# Altium schematic sheet tester.SchDoc
size A0
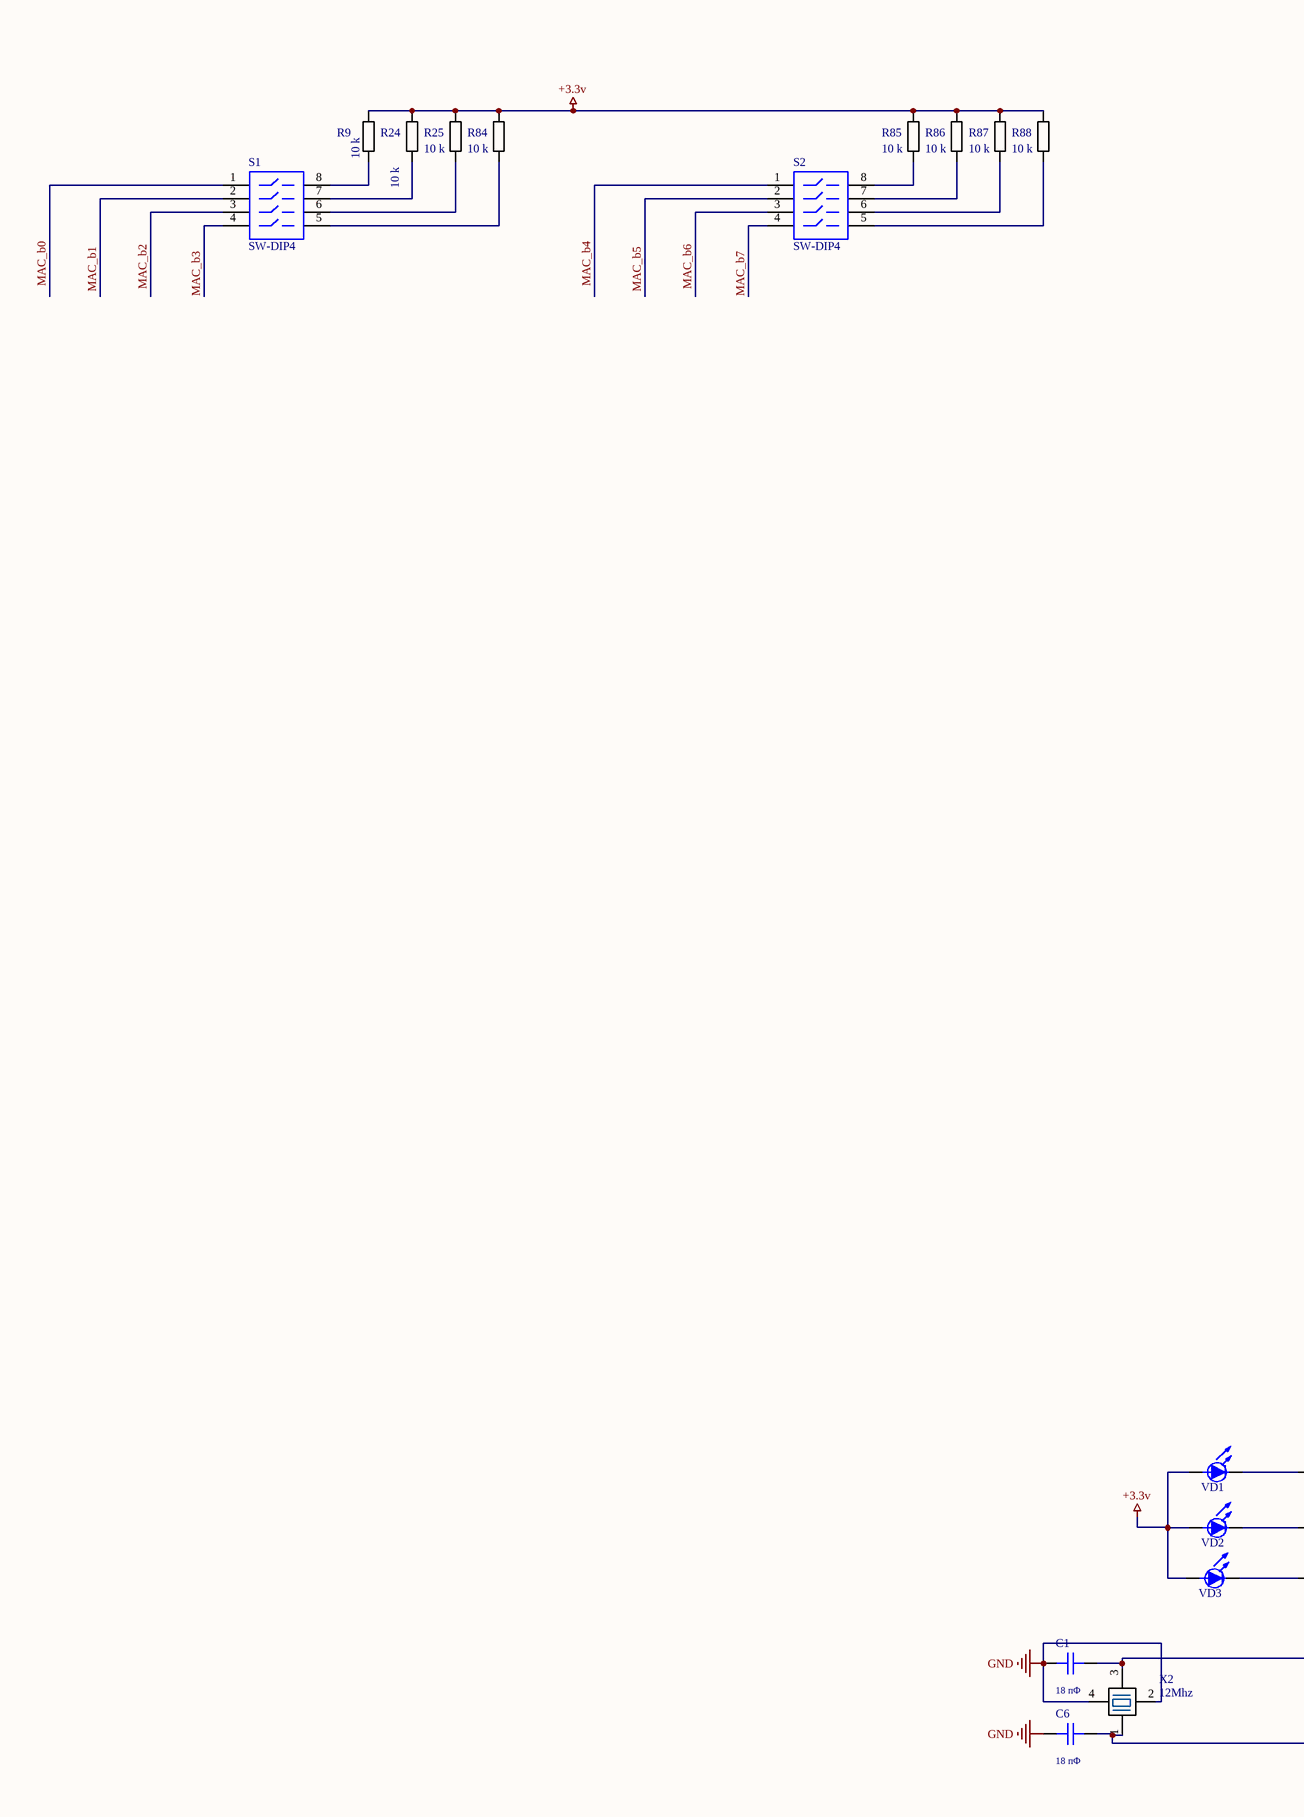
[diagram p0: tester.SchDoc, top left]
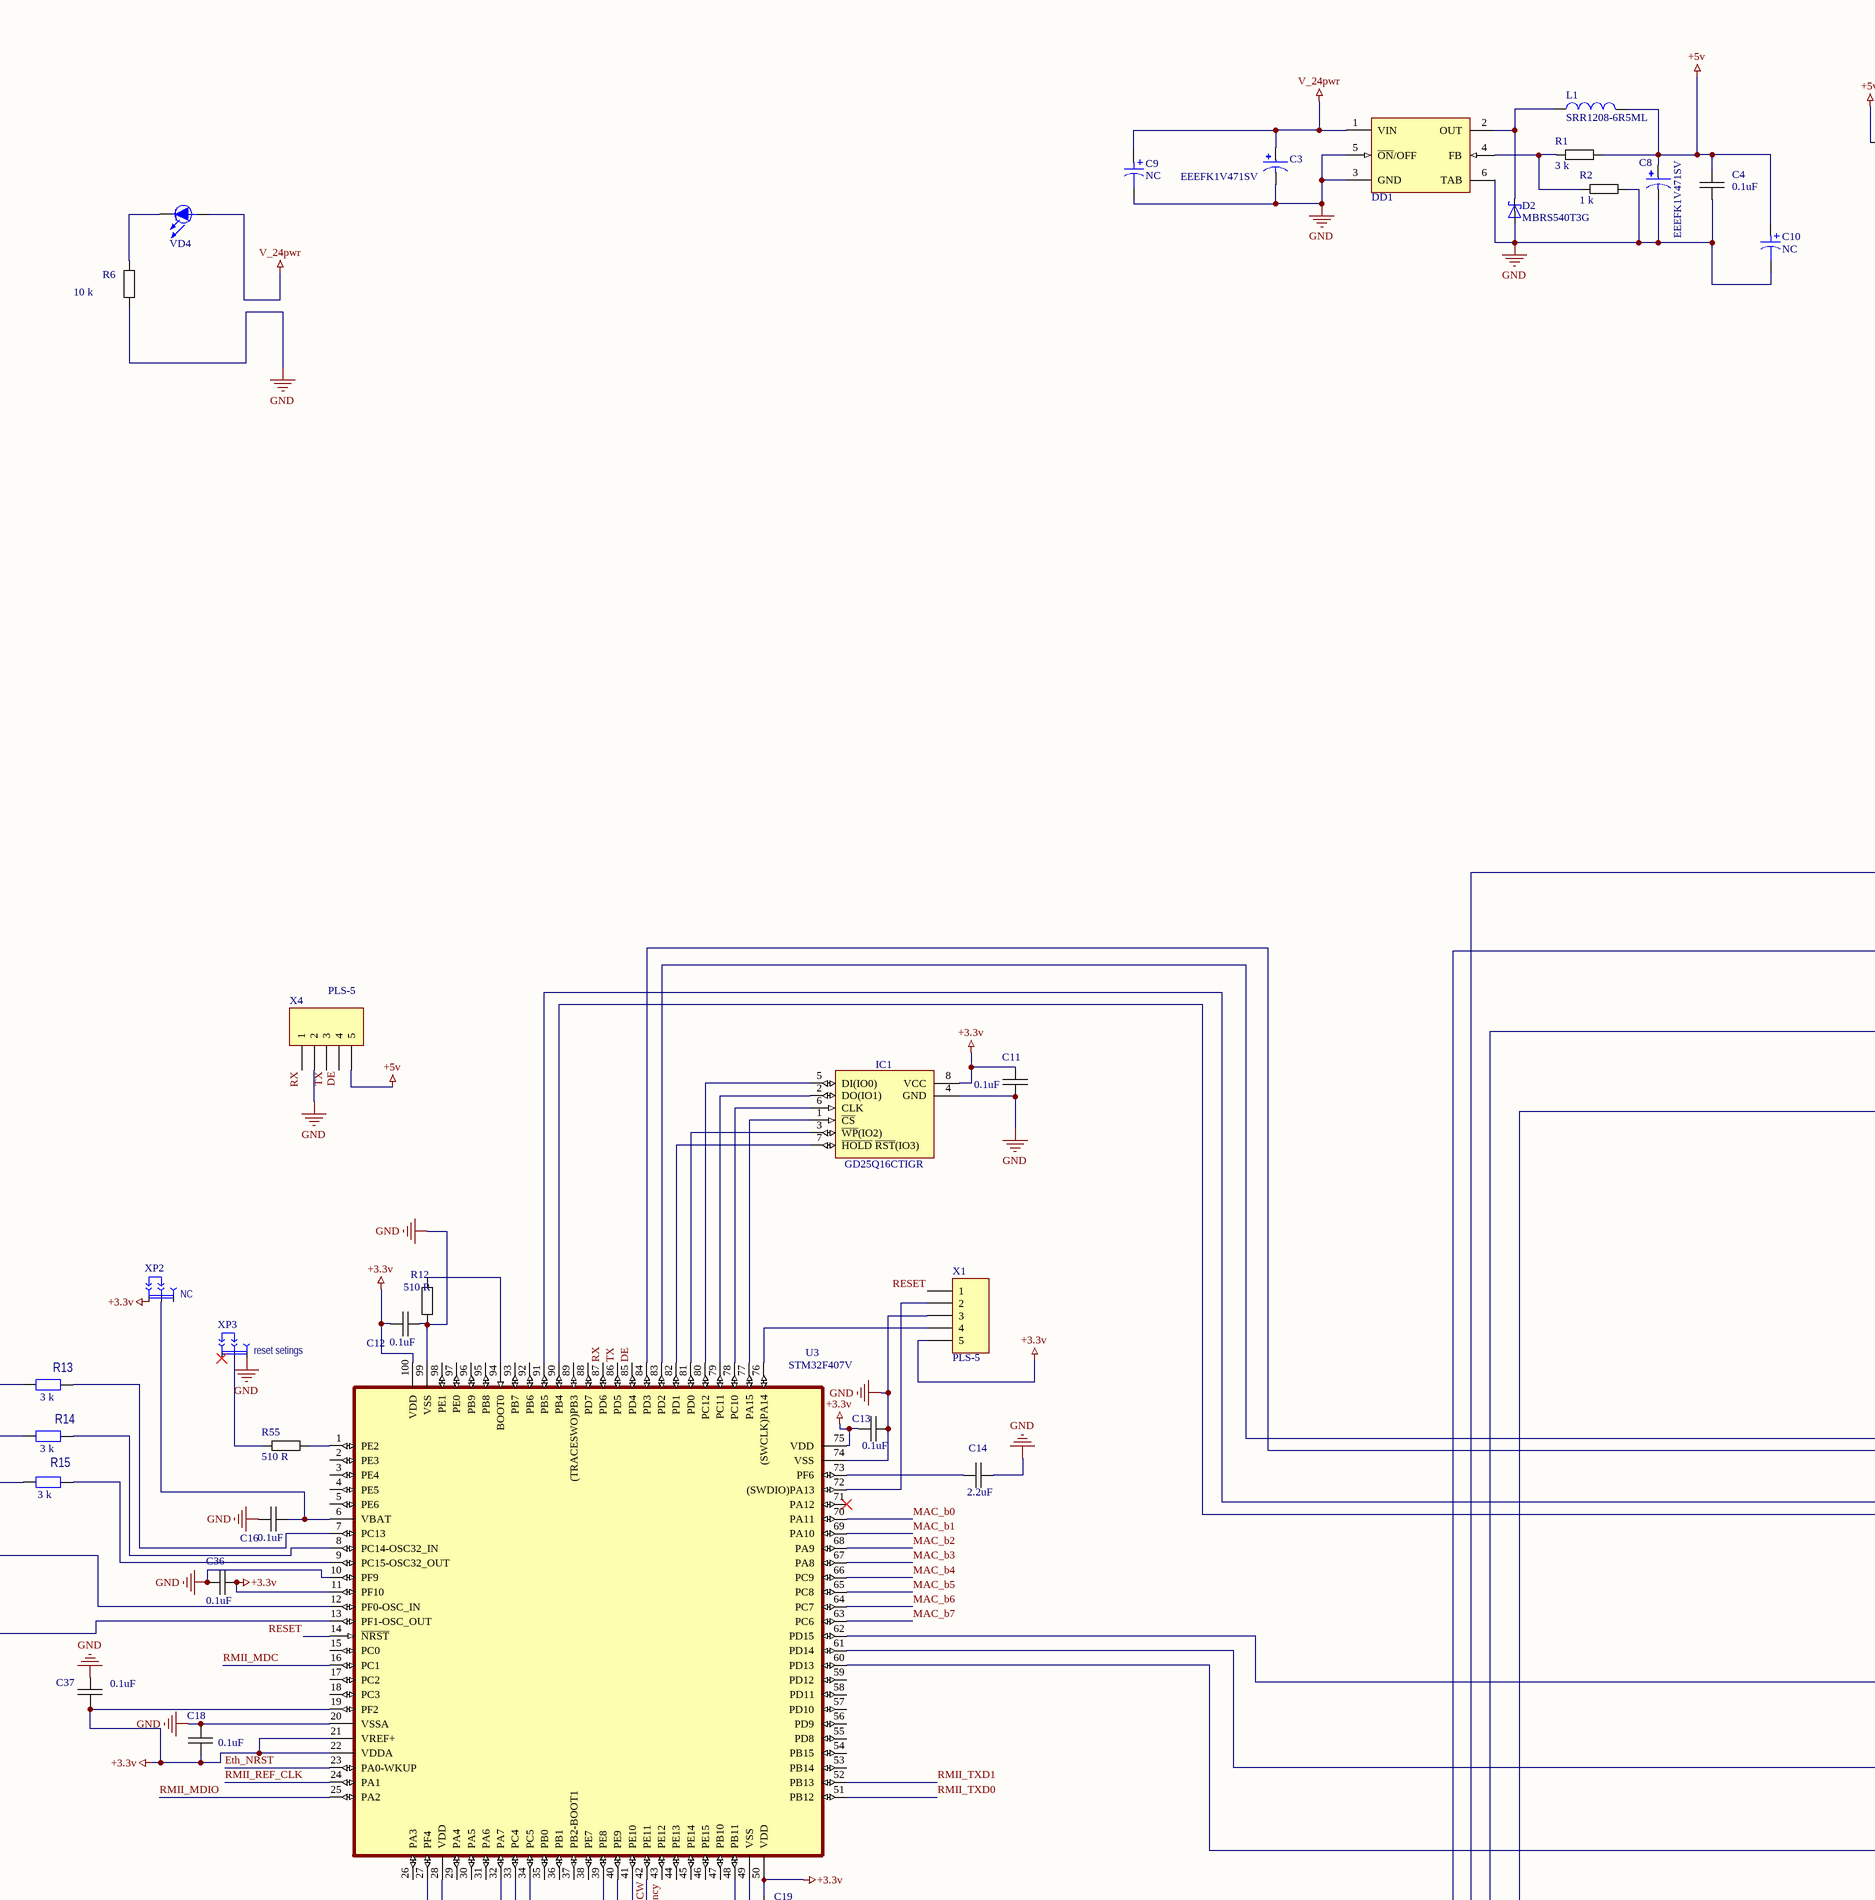
[diagram p1: tester.SchDoc, top middle]
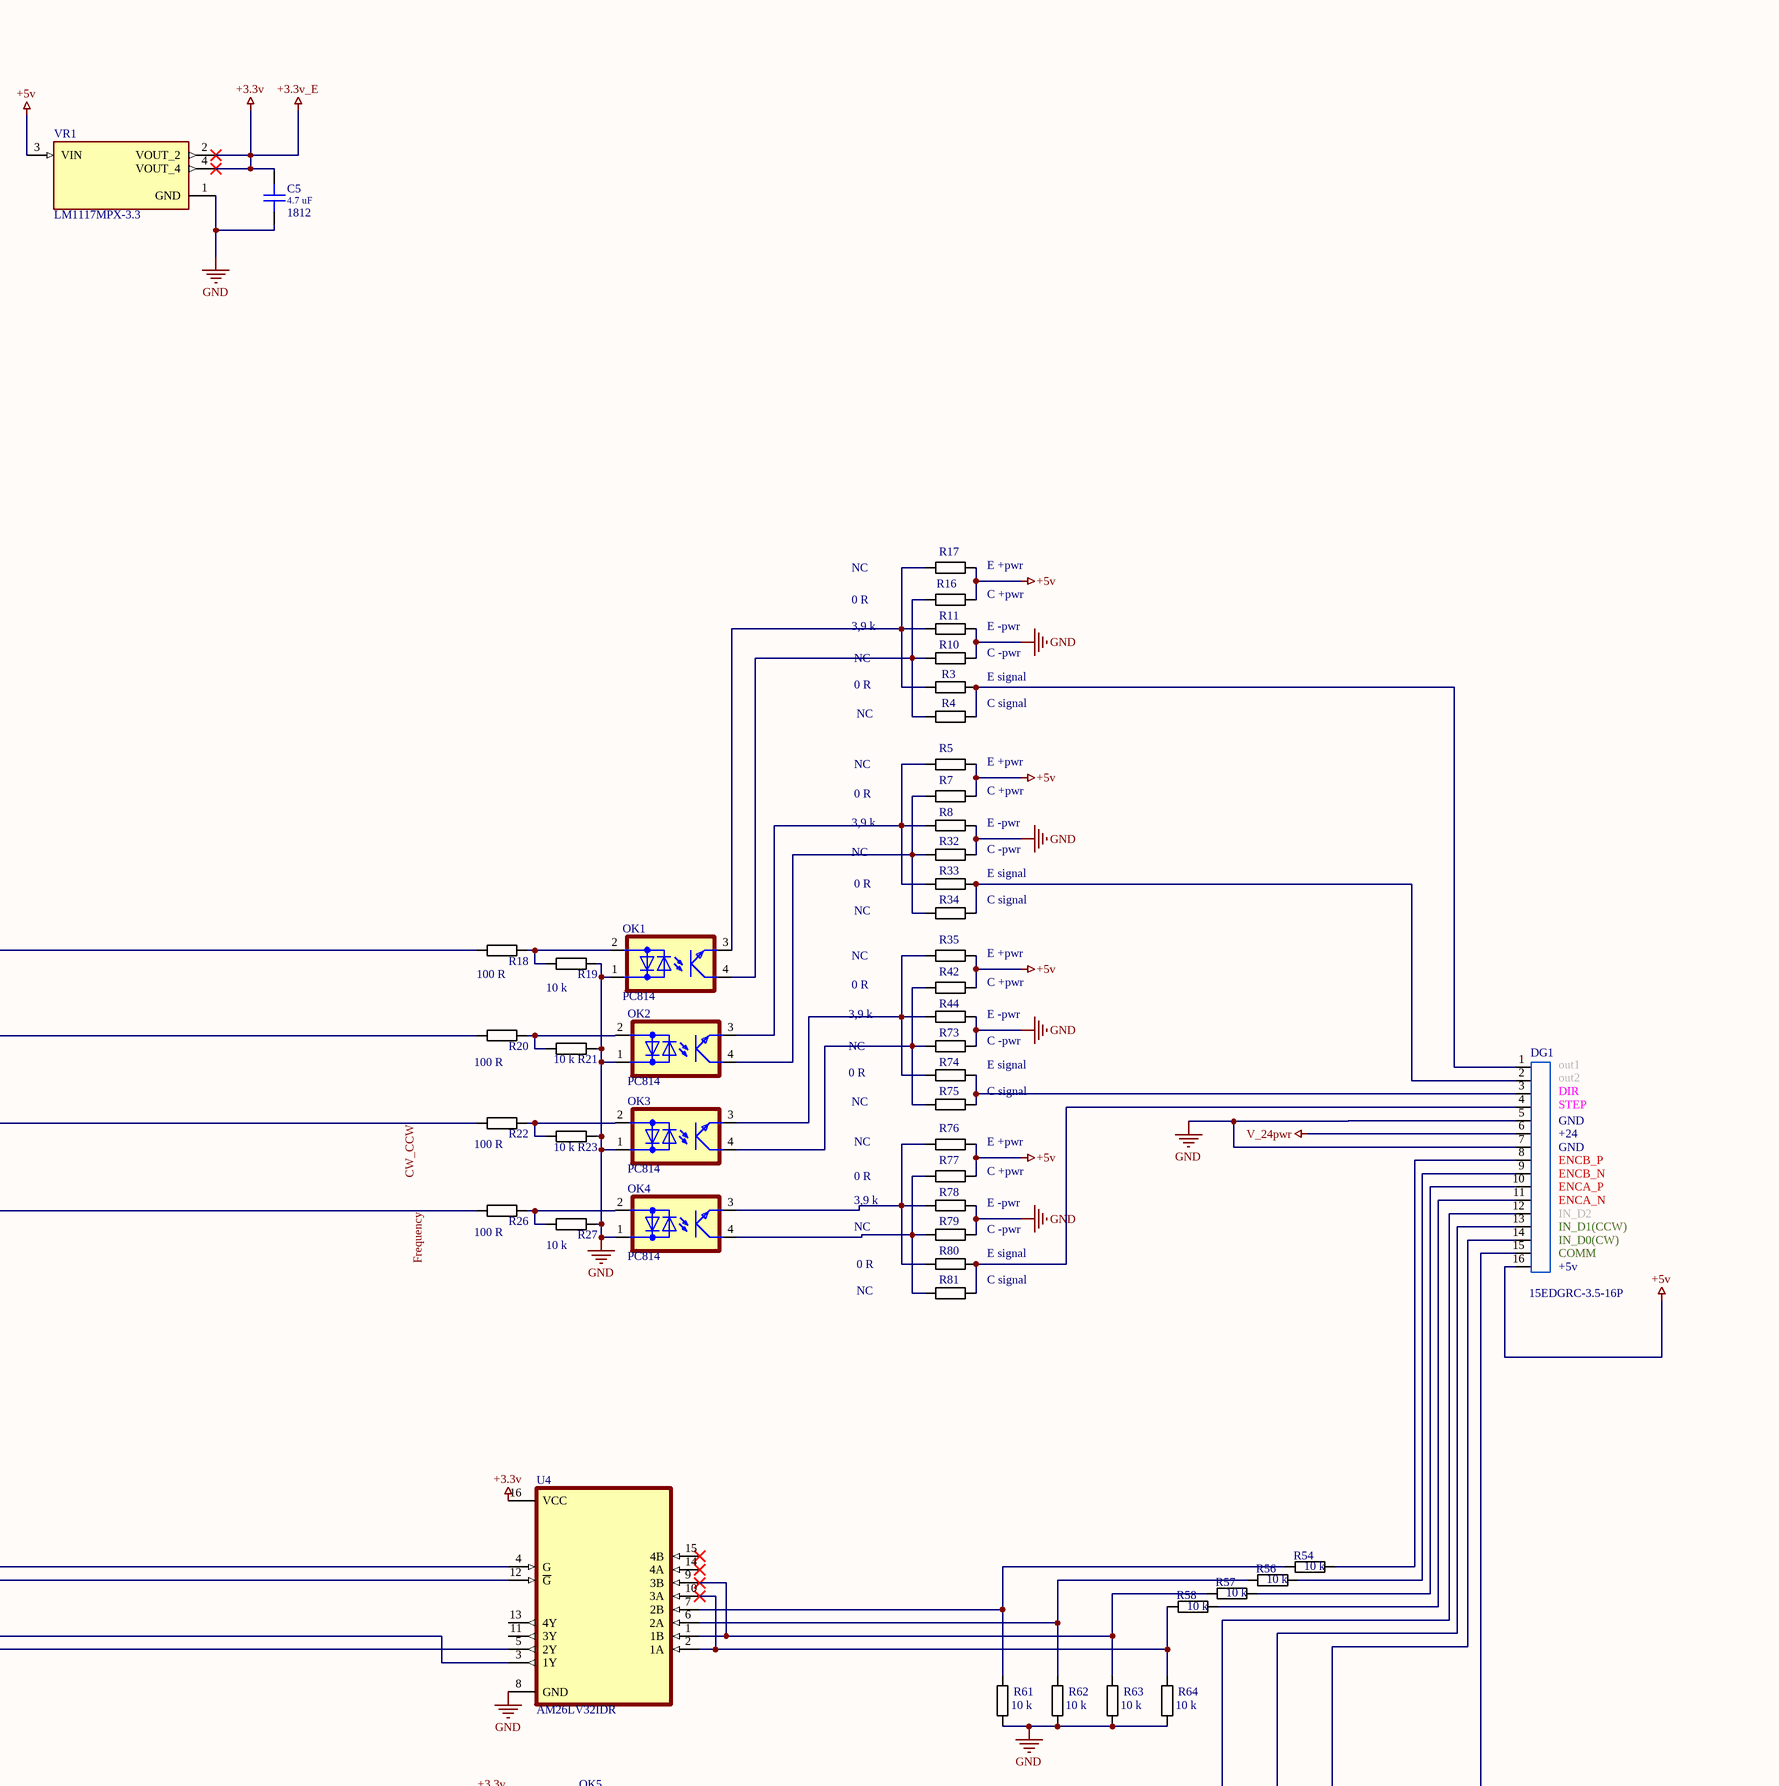
[diagram p2: tester.SchDoc, top right]
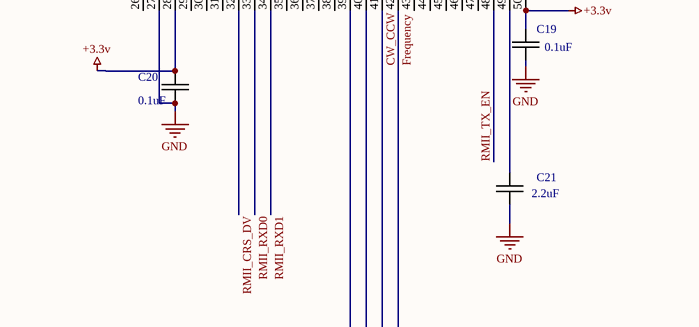
[diagram p3: tester.SchDoc, bottom middle]
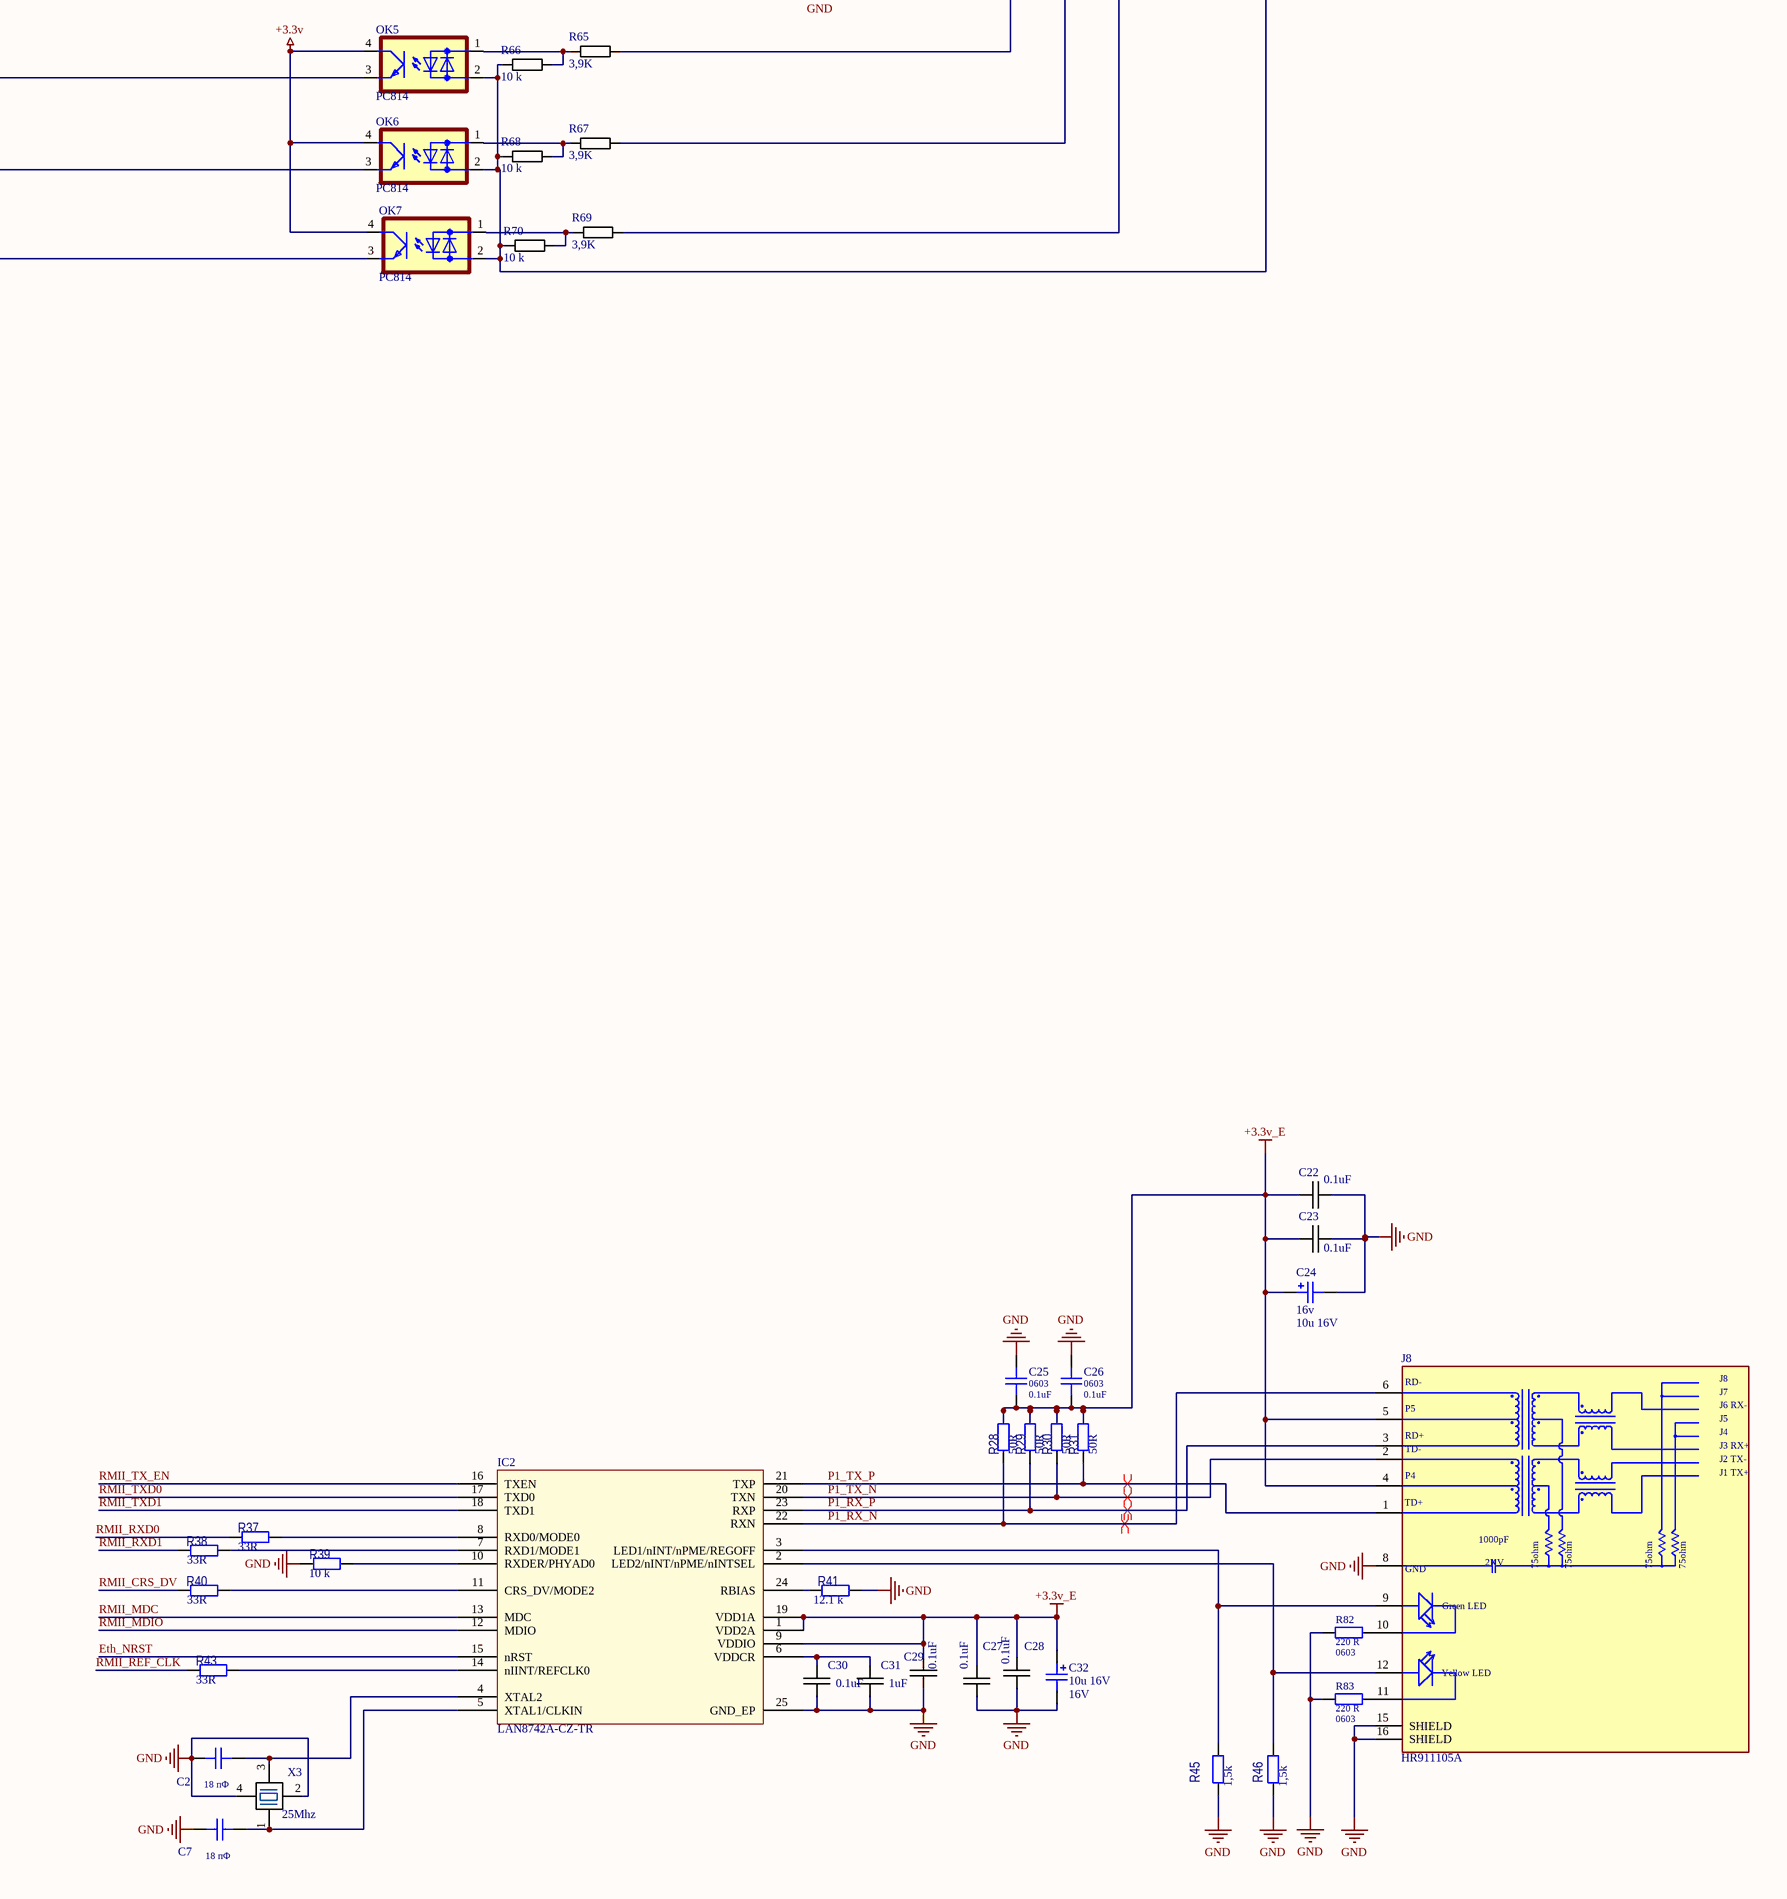
[diagram p4: tester.SchDoc, bottom right]

## Parts
C1  18 пФ  [CAPCHIP0603]
C2  18 пФ  [CAPCHIP0603]
C3  EEEFK1V471SV  [CAP_EEEFK1V471SV]
C4  0.1uF  [CAPACITOR 0603]
C5  value 4.7 uF  Package: 1812  [CAPCHIP1812]  (hidden comment: Cap C)
C6  18 пФ  [CAPCHIP0603]
C7  18 пФ  [CAPCHIP0603]
C8  EEEFK1V471SV  [CAP_EEEFK1V471SV]
C9  NC  [ECR 10x13mm]
C10  NC  [ECR 10x13mm]
C11  0.1uF  [CAPACITOR 0603]
C12  0.1uF  [CAPACITOR 0603]
C13  0.1uF  [CAPACITOR 0603]
C14  2.2uF  [CAPACITOR 0805]
C16  0.1uF  [CAPACITOR 0603]
C18  0.1uF  [CAPACITOR 0603]
C19  0.1uF  [CAPACITOR 0603]
C20  0.1uF  [CAPACITOR 0603]
C21  2.2uF  [CAPACITOR 0805]
C22  0.1uF  [CAPACITOR 0603]
C23  0.1uF  [CAPACITOR 0603]
C24  value 10u 16V  Voltage: 16v  [TECAP B]  (hidden comment: Cap T)
C25  Type: 0603  [CAPCHIP0603]  (hidden comment: 0.1uF)
C26  Type: 0603  [CAPCHIP0603]  (hidden comment: 0.1uF)
C27  0.1uF  [CAPACITOR 0603]
C28  0.1uF  [CAPACITOR 0603]
C29  0.1uF  [CAPACITOR 0603]
C30  0.1uF  [CAPACITOR 0603]
C31  1uF  [CAPACITOR 0603]
C32  Voltage: 16V  [TECAP B]  (hidden comment: 10u 16V)
C36  0.1uF  [CAPACITOR 0603]
C37  0.1uF  [CAPACITOR 0603]
D2  MBRS540T3G  [DIOM7958X213N]
DD1  LM2596S-ADJ  [TO-263]  (value not drawn)
DG1  15EDGRC-3.5-16P  [15EDGRC-3.5-16P]
IC1  GD25Q16CTIGR  [NSO8]
IC2  LAN8742A-CZ-TR  [LAN8742A]
J8  HR911105A  [HANRUN_HR911105A]
L1  SRR1208-6R5ML  [SRR1208]
OK1  PC814  [DIL04]
OK2  PC814  [DIL04]
OK3  PC814  [DIL04]
OK4  PC814  [DIL04]
OK5  PC814  [DIL04]
OK6  PC814  [DIL04]
OK7  PC814  [DIL04]
R1  3 k  [Resistor 0603]
R2  1 k  [Resistor 0603]
R3  0 R  [Resistor 0402]
R4  NC  [Resistor 0402]
R5  NC  [Resistor 0402]
R6  10 k  [Resistor 0805]
R7  0 R  [Resistor 0402]
R8  3,9 k  [Resistor 0402]
R9  10 k  [Resistor 0402]
R10  NC  [Resistor 0402]
R11  3,9 k  [Resistor 0402]
R12  510 R  [Resistor 0805]
R13  3 k  [RESCHIP0603]
R14  3 k  [RESCHIP0603]
R15  3 k  [RESCHIP0603]
R16  0 R  [Resistor 0402]
R17  NC  [Resistor 0402]
R18  100 R  [Resistor 0805]
R19  10 k  [Resistor 0402]
R20  100 R  [Resistor 0805]
R21  10 k  [Resistor 0402]
R22  100 R  [Resistor 0805]
R23  10 k  [Resistor 0402]
R24  10 k  [Resistor 0402]
R25  10 k  [Resistor 0402]
R26  100 R  [Resistor 0805]
R27  10 k  [Resistor 0402]
R28  50R  [RESCHIP0603]
R29  50R  [RESCHIP0603]
R30  50R  [RESCHIP0603]
R31  50R  [RESCHIP0603]
R32  NC  [Resistor 0402]
R33  0 R  [Resistor 0402]
R34  NC  [Resistor 0402]
R35  NC  [Resistor 0402]
R37  33R  [RESCHIP0603]
R38  33R  [RESCHIP0603]
R39  10 k  [RESCHIP0603]
R40  33R  [RESCHIP0603]
R41  12.1 k  [RESCHIP0603]
R42  0 R  [Resistor 0402]
R43  33R  [RESCHIP0603]
R44  3,9 k  [Resistor 0402]
R45  1,5k  [RESCHIP0603]
R46  1,5k  [RESCHIP0603]
R54  10 k  [Resistor 0402]
R55  510 R  [Resistor 0805]
R56  10 k  [Resistor 0402]
R57  10 k  [Resistor 0402]
R58  10 k  [Resistor 0402]
R61  10 k  [Resistor 0402]
R62  10 k  [Resistor 0402]
R63  10 k  [Resistor 0402]
R64  10 k  [Resistor 0402]
R65  3,9K  [Resistor 0805]
R66  10 k  [Resistor 0402]
R67  3,9K  [Resistor 0805]
R68  10 k  [Resistor 0402]
R69  3,9K  [Resistor 0805]
R70  10 k  [Resistor 0402]
R73  NC  [Resistor 0402]
R74  0 R  [Resistor 0402]
R75  NC  [Resistor 0402]
R76  NC  [Resistor 0402]
R77  0 R  [Resistor 0402]
R78  3,9 k  [Resistor 0402]
R79  NC  [Resistor 0402]
R80  0 R  [Resistor 0402]
R81  NC  [Resistor 0402]
R82  Type: 0603  [RESCHIP0603]  (hidden comment: 220 R)
R83  Type: 0603  [RESCHIP0603]  (hidden comment: 220 R)
R84  10 k  [Resistor 0402]
R85  10 k  [Resistor 0402]
R86  10 k  [Resistor 0402]
R87  10 k  [Resistor 0402]
R88  10 k  [Resistor 0402]
S1  SW-DIP4  [DIP-8]
S2  SW-DIP4  [DIP-8]
U3  STM32F407V  [QFP50P1600X1600X160-100N]
U4  AM26LV32IDR  [SOIC127P600X175-16N]
VD1  (no value)  [0805-]
VD2  (no value)  [0805-]
VD3  (no value)  [0805-]
VD4  (no value)  [0805-]
VR1  LM1117MPX-3.3  [VREG_LM1117MPX-3.3]
X1  PLS-5  [PLS-5-3D]
X2  12Mhz  [XTAL_3.2_2.5]
X3  25Mhz  [XTAL_3.2_2.5]
X4  PLS-5  [PLS-5-3D]
XP2  NC  [ZL201-3]
XP3  reset setings  [ZL201-3]

## Nets
+3.3v: C5.2 C11.1 C12.1 C13.1 C18.2 C19.1 C20.1 C22.1 C23.1 C24.1 C25.1 C26.1 C27.1 C28.2 C29.1 C32.1 C36.2 C37.2 IC1.8(VCC) IC2.1(VDD2A) IC2.9(VDDIO) IC2.19(VDD1A) J8.4(P4) J8.5(P5) OK5.4(C) OK6.4(C) OK7.4(C) R9.1 R24.1 R25.1 R28.2 R29.2 R30.2 R31.2 R84.1 R85.1 R86.1 R87.1 R88.1 U3.11(PF10) U3.19(PF2) U3.21(VREF+) U3.22(VDDA) U3.28(VDD) U3.50(VDD) U3.75(VDD) U3.100(VDD) U4.16(VCC) VD1.A(a) VD2.A(a) VD3.A(a) VR1.2(VOUT_2) VR1.4(VOUT_4) X1.5 XP2.1  [also labelled +3.3v_E]
+5v: C4.2 C8.1 C10.1 DG1.16 L1.P$2 R1.2 R5.1 R7.1 R16.1 R17.1 R35.1 R42.1 R76.1 R77.1 VR1.3(VIN) X4.5
GND: C1.1 C2.1 C3.2 C4.1 C5.1 C6.1 C7.1 C8.2 C9.2 C10.2 C11.2 C12.2 C13.2 C14.2 C16.1 C18.1 C19.2 C20.2 C21.1 C22.2 C23.2 C24.2 C25.2 C26.2 C27.2 C28.1 C29.2 C30.2 C31.2 C32.2 C36.1 C37.1 D2.A DD1.3(GND) DD1.5(~{ON}/OFF) DD1.6(TAB) DG1.5 DG1.7 IC1.4(GND) IC2.25(GND_EP) J8.8(GND) J8.15(SHIELD) J8.16(SHIELD) OK1.1(AC1) OK2.1(AC1) OK3.1(AC1) OK4.1(AC1) R2.2 R6.2 R8.1 R10.1 R11.1 R12.2 R19.2 R21.2 R23.2 R27.2 R32.1 R39.1 R41.2 R44.1 R45.1 R46.1 R61.1 R62.1 R63.1 R64.1 R73.1 R78.1 R79.1 R82.1 R83.1 U3.10(PF9) U3.20(VSSA) U3.27(PF4) U3.74(VSS) U3.99(VSS) U4.8(GND) VR1.1(GND) X1.3 X2.2 X2.4 X3.2 X3.4 X4.2 XP3.3
V_24pwr: C3.1 C9.1 DD1.1(VIN) DG1.6 VD4.A(a)
CW_CCW: R22.1 U3.41(PE10)
DE: U3.85(PD4) X4.4
Eth_NRST: IC2.15(nRST) U3.23(PA0-WKUP)
Frequency: R26.1 U3.42(PE11)
MAC_b0: S1.1 U3.70(PA11)
MAC_b1: S1.2 U3.69(PA10)
MAC_b2: S1.3 U3.68(PA9)
MAC_b3: S1.4 U3.67(PA8)
MAC_b4: S2.1 U3.66(PC9)
MAC_b5: S2.2 U3.65(PC8)
MAC_b6: S2.3 U3.64(PC7)
MAC_b7: S2.4 U3.63(PC6)
P1_RX_N: IC2.22(RXN) J8.6(RD-) R28.1
P1_RX_P: IC2.23(RXP) J8.3(RD+) R29.1
P1_TX_N: IC2.20(TXN) J8.2(TD-) R30.1
P1_TX_P: IC2.21(TXP) J8.1(TD+) R31.1
RESET: U3.14(~{NRST}) X1.1
RMII_CRS_DV: R40.1 U3.32(PA7)
RMII_MDC: IC2.13(MDC) U3.16(PC1)
RMII_MDIO: IC2.12(MDIO) U3.25(PA2)
RMII_REF_CLK: R43.1 U3.24(PA1)
RMII_RXD0: R37.1 U3.33(PC4)
RMII_RXD1: R38.1 U3.34(PC5)
RMII_TX_EN: IC2.16(TXEN) U3.48(PB11)
RMII_TXD0: IC2.17(TXD0) U3.51(PB12)
RMII_TXD1: IC2.18(TXD1) U3.52(PB13)
RX: U3.87(PD6) X4.1
TX: U3.86(PD5) X4.3
NetC1_2: C1.2 U3.12(PF0-OSC_IN) X2.3
NetC2_2: C2.2 IC2.4(XTAL2) X3.3
NetC6_2: C6.2 U3.13(PF1-OSC_OUT) X2.1
NetC7_2: C7.2 IC2.5(XTAL1/CLKIN) X3.1
NetC14_1: C14.1 U3.73(PF6)
NetC16_2: C16.2 U3.6(VBAT) XP2.2
NetC21_2: C21.2 U3.49(VSS)
NetC30_1: C30.1 C31.1 IC2.6(VDDCR)
NetD2_C: D2.C DD1.2(OUT) L1.P$1
NetDD1_4: DD1.4(FB) R1.1 R2.1
NetDG1_1: DG1.1 R3.1 R4.1
NetDG1_2: DG1.2 R33.1 R34.1
NetDG1_3: DG1.3 R74.1 R75.1
NetDG1_4: DG1.4 R80.1 R81.1
NetDG1_8: DG1.8 R54.1
NetDG1_9: DG1.9 R56.1
NetDG1_10: DG1.10 R57.1
NetDG1_11: DG1.11 R58.1
NetDG1_12: DG1.12 R65.1
NetDG1_13: DG1.13 R67.1
NetDG1_14: DG1.14 R69.1
NetDG1_15: DG1.15 OK5.2(AC2) OK6.2(AC2) OK7.2(AC2) R66.2 R68.2 R70.2
NetIC1_1: IC1.1(~{CS}) U3.77(PA15)
NetIC1_2: IC1.2(DO(IO1)) U3.79(PC11)
NetIC1_3: IC1.3(~{WP}(IO2)) U3.81(PD0)
NetIC1_5: IC1.5(DI(IO0)) U3.80(PC12)
NetIC1_6: IC1.6(CLK) U3.78(PC10)
NetIC1_7: IC1.7(~{HOLD}_~{RST}(IO3)) U3.82(PD1)
NetIC2_2: IC2.2(LED2/nINT/nPME/nINTSEL) J8.12(YA) R46.2
NetIC2_3: IC2.3(LED1/nINT/nPME/REGOFF) J8.9(GA) R45.2
NetIC2_7: IC2.7(RXD1/MODE1) R38.2
NetIC2_8: IC2.8(RXD0/MODE0) R37.2
NetIC2_10: IC2.10(RXDER/PHYAD0) R39.2
NetIC2_11: IC2.11(CRS_DV/MODE2) R40.2
NetIC2_14: IC2.14(nIINT/REFCLK0) R43.2
NetIC2_24: IC2.24(RBIAS) R41.1
NetJ8_10: J8.10(GC) R82.2
NetJ8_11: J8.11(YC) R83.2
NetOK1_2: OK1.2(AC2) R18.2 R19.1
NetOK1_3: OK1.3(E) R3.2 R11.2 R17.2
NetOK1_4: OK1.4(C) R4.2 R10.2 R16.2
NetOK2_2: OK2.2(AC2) R20.2 R21.1
NetOK2_3: OK2.3(E) R5.2 R8.2 R33.2
NetOK2_4: OK2.4(C) R7.2 R32.2 R34.2
NetOK3_2: OK3.2(AC2) R22.2 R23.1
NetOK3_3: OK3.3(E) R35.2 R44.2 R74.2
NetOK3_4: OK3.4(C) R42.2 R73.2 R75.2
NetOK4_2: OK4.2(AC2) R26.2 R27.1
NetOK4_3: OK4.3(E) R76.2 R78.2 R80.2
NetOK4_4: OK4.4(C) R77.2 R79.2 R81.2
NetOK5_1: OK5.1(AC1) R65.2 R66.1
NetOK5_3: OK5.3(E) U3.62(PD15)
NetOK6_1: OK6.1(AC1) R67.2 R68.1
NetOK6_3: OK6.3(E) U3.61(PD14)
NetOK7_1: OK7.1(AC1) R69.2 R70.1
NetOK7_3: OK7.3(E) U3.60(PD13)
NetR6_1: R6.1 VD4.K(k)
NetR9_2: R9.2 S1.8
NetR12_1: R12.1 U3.94(BOOT0)
NetR13_1: R13.1 U3.7(PC13)
NetR13_2: R13.2 VD1.K(k)
NetR14_1: R14.1 U3.8(PC14-OSC32_IN)
NetR14_2: R14.2 VD2.K(k)
NetR15_1: R15.1 U3.9(PC15-OSC32_OUT)
NetR15_2: R15.2 VD3.K(k)
NetR18_1: R18.1 U3.40(PE9)
NetR20_1: R20.1 U3.39(PE8)
NetR24_2: R24.2 S1.7
NetR25_2: R25.2 S1.6
NetR54_2: R54.2 R61.2 U4.7(2B)
NetR55_1: R55.1 XP3.2
NetR55_2: R55.2 U3.1(PE2)
NetR56_2: R56.2 R62.2 U4.6(2A)
NetR57_2: R57.2 R63.2 U4.1(1B) U4.9(3B)
NetR58_2: R58.2 R64.2 U4.2(1A) U4.10(3A)
NetR84_2: R84.2 S1.5
NetR85_2: R85.2 S2.8
NetR86_2: R86.2 S2.7
NetR87_2: R87.2 S2.6
NetR88_2: R88.2 S2.5
NetU3_72: U3.72((SWDIO)PA13) X1.2
NetU3_76: U3.76((SWCLK)PA14) X1.4
NetU3_83: U3.83(PD2) U4.4(G)
NetU3_84: U3.84(PD3) U4.12(~{G})
NetU3_90: U3.90(PB4) U4.5(2Y)
NetU3_91: U3.91(PB5) U4.3(1Y)

Not connected (* = marked no-connect by the designer): U3 2(PE3) 3(PE4) 4(PE5) 5(PE6) 15(PC0) 17(PC2) 18(PC3) 26(PA3) 29(PA4) 30(PA5) 31(PA6) 35(PB0) 36(PB1) 37(PB2-BOOT1) 38(PE7) 43(PE12) 44(PE13) 45(PE14) 46(PE15) 47(PB10) 53(PB14) 54(PB15) 55(PD8) 56(PD9) 57(PD10) 58(PD11) 59(PD12) 71(PA12)* 88(PD7) 89((TRACESWO)PB3) 92(PB6) 93(PB7) 95(PB8) 96(PB9) 97(PE0) 98(PE1); U4 11(3Y) 13(4Y) 14(4A)* 15(4B)*; XP2 3; XP3 1*

## Layout directives
differential pair: P1_RX_N, P1_RX_P, P1_TX_N, P1_TX_P

## Notes on the sheet
- (near R17) E +pwr
- (near R16) C +pwr
- (near R11) E -pwr
- (near R10) C -pwr
- E signal
- C signal
- (near R5) E +pwr
- (near R7) C +pwr
- (near R8) E -pwr
- (near R32) C -pwr
- (near R35) E +pwr
- (near R42) C +pwr
- (near R73) C -pwr
- (near R44) E -pwr
- (near DG1) out1
- (near DG1) out2
- (near DG1) DIR
- (near DG1) STEP
- (near R76) E +pwr
- (near R77) C +pwr
- (near DG1) GND
- (near DG1) +24
- (near DG1) ENCB_P
- (near DG1) ENCB_N
- (near R79) C -pwr
- (near R78) E -pwr
- (near DG1) ENCA_P
- (near DG1) ENCA_N
- (near DG1) IN_D2
- (near DG1) IN_D1(CCW)
- (near DG1) IN_D0(CW)
- (near DG1) COMM
- (near DG1) +5v
- (in symbol HR911105A) J7; J6 RX-; J5; J4; J3 RX+; J2 TX-; J1 TX+; 1000pF; 2KV; 75ohm; Green LED; Yellow LED

## Library data of the parts
C1 C2 C6 C7 C25 C26 = Cap C: Керамическтй конденсатор SMD C0603; Package: 0603
  C1 C2 C6 C7: Value: 18 пФ
  C25 C26: Value: 0.1uF
C3 C8 = EEEFK1V471SV: 470ÂµF 35V Aluminum Electrolytic Capacitors Radial, Can - SMD 80mOhm @ 100kHz 2000 Hrs @ 105Â°C; MP: EEE-FK1V471SV; Value: 470uF 35V; MF: Panasonic Electronic Components; Package: EEEFK1V471SV; Availability: In Stock; SnapEDA_Link: https://www.snapeda.com/parts/EEE-FK1V471SV/Panasonic/view-part/?ref=snap; Price: None; Check_prices: https://www.snapeda.com/parts/EEE-FK1V471SV/Panasonic/view-part/?ref=eda; Purchase-URL: https://pricing.snapeda.com/search/part/EEE-FK1V471SV/?ref=eda; Type: SMD
C4 C11-C14 C16 C18-C23 C27-C31 C36 C37 = Capasitor
  C4 C11-C13 C16 C18-C20 C22 C23 C27-C30 C36 C37: Value: 0.1uF; Package: 0603
  C14 C21: Value: 2.2uF; Package: 0805
  C31: Value: 1uF; Package: 0603
C5 = Cap C: Ceramic Capacitor; Class: Электронные компоненты; SubClass: Конденсаторы; TKE: {TKE}; Ordering_Information: {Ordering_Information}; Installation: {Installation}; Body: {Body}; Nominal_voltage_V: {Nominal_voltage_V}; Tolerance_Percent: {Tolerance_Percent}; Pins: {Pins}
C9 C10 = Cap Pol: Polarized Capacitor (Rad); Voltage: 220uF   50; Type: Type; URL: http://www.hitano.com.tw/PDF/ECR_081225.pdf; Value: NC; Package: 10x13
C24 C32 = Cap T: Solid Tantalum Surface Mount Capacitors; Package: TECAP B
  C24: Type: Type
  C32: Value: 10u 16V; Type: TECAP B
D2 = MBRS540T3G: Diode Schottky 40V 5A Surface Mount SMC; MF: ON Semiconductor; SnapEDA_Link: https://www.snapeda.com/parts/MBRS540T3G/ON%20Semiconductor/view-part/78777/?ref=snap; MP: MBRS540T3G; Availability: Unavailable; Price: None; Value: MBRS540T3G; Package: SMC
DD1 = LM2596S-ADJ: SIMPLE SWITCHER® Power Converter 150 KHz 3A Step-Down Voltage Regulator, 5-pin TO-263; Manufacturer: National Semiconductor; Published: 13.04.2012; Publisher: Reukov A.V.; PartNumber: LM2596S-ADJ; CompType: Switcher; ComponentLink1URL: http://www.national.com/ds/LM/LM2596.pdf; ComponentLink2URL: http://www.national.com/pf/LM/LM2596.html; ComponentLink3URL: http://www.national.com/packaging/folders/ts5b.html; Value: LM2596S-ADJ; Package: TO-263 KTT
IC1 = W25Q128FVEIG: 128M-bit Serial Flash Memory with uniform 4KB sectors and Dual/Quad SPI and QPI; Value: GD25Q16CT; Package: VSOP8
J8 = HR911105A: HR911105A Ethernet Interface Arduino Platform Evaluation Expansion Board; MF: DFRobot; Package: None; Availability: Unavailable; MP: HR911105A; Value: HR911105A; SnapEDA_Link: https://www.snapeda.com/parts/HR911105A/DFRobot/view-part/214807/?ref=snap; Price: None
L1 = SRR1208-6R5ML: 6.5ÂµH Shielded Wirewound Inductor 6A 18mOhm Max Nonstandard; MF: Bourns; Value: 6,5uH; Availability: Unavailable; SnapEDA_Link: https://www.snapeda.com/parts/SRR1208-6R5ML/Bourns/view-part/353452/?ref=snap; Package: SRR1208-6R5ML; MP: SRR1208-6R5ML; Price: None
OK1-OK7 = PC814: #10-32 Round Head Machine Screw Slotted Drive Nylon; MF: Essentra Components; Package: DIP-4 Sharp; Value: PC814; Price: None; MP: PC814; Availability: Unavailable; SnapEDA_Link: https://www.snapeda.com/parts/PC814/Essentra%20Components/view-part/624045/?ref=snap
R1-R12 R16-R27 R32-R35 R42 R44 R54-R58 R61-R70 R73-R81 R84-R88 = Resistor
  R1: Value: 3 k; Package: 0603
  R2: Value: 1 k; Package: 0603
  R3 R7 R16 R33 R42 R74 R77 R80: Value: 0 R; Package: 0402
  R4 R5 R10 R17 R32 R34 R35 R73 R75 R76 R79 R81: Value: NC; Package: 0402
  R6: Value: 10 k; Package: 0805
  R8 R11 R44 R78: Value: 3,9 k; Package: 0402
  R9 R19 R21 R23-R25 R27 R54 R56-R58 R61-R64 R66 R68 R70 R84-R88: Value: 10 k; Package: 0402
  R12 R55: Value: 510 R; Package: 0805
  R18 R20 R22 R26: Value: 100 R; Package: 0805
  R65 R67 R69: Value: 3,9K; Package: 0805
R13-R15 = Res: Resistor; Tolerance_Percent: {Tolerance_Percent}; Value: 3 k; Pins: 2; Package: 0603; CompType: Resistor
R28-R31 R37-R41 R43 R45 R46 = Res: Резистор; Tolerance_Percent: {Tolerance_Percent}; Class: Электронные компоненты; SubClass: Резисторы; Power_W: {Power_W}; Installation: {Installation}; Ordering_Information: {Ordering_Information}; Body: {Body}; Pins: 2; Package: 0603
  R28-R31: Value: 50R
  R37 R38 R40 R43: Value: 33R
  R39: Value: 10 k
  R41: Value: 12.1 k
  R45 R46: Value: 1,5k
R82 R83 = Res: Резистор SMD R0603; Tolerance: %; PWR: Value; Value: 220 R; Package: 0603
S1 S2 = SW-DIP4: DIP Switch; Value: DS1040-04RN; Published: 24-Mar-1999; LatestRevisionDate: 17-Jul-2002; LatestRevisionNote: Re-released for DXP Platform.; PackageReference: DIP-8; Publisher: Altium Limited; Package: SW-DIP8
U3 = STM32F303V: ARMÂ® CortexÂ®-M4 STM32F3 Microcontroller IC 32-Bit 72MHz 100-LQFP (14x14); MF: STMicroelectronics; Price: None; Value: STM32F407V; Availability: Unavailable; Package: LQFP-100 STMicroelectronics; MP: STM32F303V
U4 = AM26LV32IDR: Low-Voltage High-Speed Quadruple Differential Line Receiver 16-SOIC -40 to 85; MF: Texas Instruments; MP: AM26LV32IDR; Package: SOIC-16 Texas Instruments; Purchase-URL: https://pricing.snapeda.com/search/part/AM26LV32IDR/?ref=eda; SnapEDA_Link: https://www.snapeda.com/parts/AM26LV32IDR/Texas%20Instruments/view-part/95750/?ref=snap; Availability: Good; Price: None; Value: AM26LV32IDR; Check_prices: https://www.snapeda.com/parts/AM26LV32IDR/Texas%20Instruments/view-part/95750/?ref=eda
VD1 VD4 = LED SMD: Value: Green; CompType: LED; Note: Read; Pins: 2; Package: 0805
VD2 = LED SMD: Value: Green; CompType: LED; Pins: 2; Package: 0805; Note: Green
VD3 = LED SMD: Value: Green; CompType: LED; Note: Blue; Pins: 2; Package: 0805
VR1 = LM1117MPX-3.3: 800-mA 15-V linear voltage regulator; MF: Texas Instruments; Check_prices: https://www.snapeda.com/parts/LM1117MPX-3.3/Texas+Instruments/view-part/?ref=eda; Value: LM1117MPX-3.3; Availability: In Stock; MP: LM1117MPX-3.3; Price: None; Package: SOT-223-4 Texas Instruments; SnapEDA_Link: https://www.snapeda.com/parts/LM1117MPX-3.3/Texas+Instruments/view-part/?ref=snap; Purchase-URL: https://pricing.snapeda.com/search/part/LM1117MPX-3.3/?ref=eda
X1 X4 = PLS-5: Header, 5-Pin; LatestRevisionDate: 17-Jul-2002; LatestRevisionNote: Re-released for DXP Platform.; Publisher: Altium Limited; Value: PLS-5; Package: PLS-5
X2 X3 = XTAL 2-pin: Package: SMD 3.3_2.5
  X2: Value: 12Mhz
  X3: Value: 25Mhz
XP2 = Select jump: Class: Электронные компоненты; SubClass: Разъемы; Pitch_mm: {Pitch_mm}; Installation: DIP; Ordering_Information: {Ordering_Information}; Type_of_connector: {Type_of_connector}; Pins: 3; Value: NC; Package: PLS-3
XP3 = Select jump: Ter120; Class: Электронные компоненты; SubClass: Разъемы; Pitch_mm: {Pitch_mm}; Installation: DIP; Ordering_Information: {Ordering_Information}; Type_of_connector: {Type_of_connector}; Pins: 3; Value: reset setings; Package: PLS-3
DG1 = 15EDGRC-3.5-16P: Package: 15EDGRC-3.5-16P; Value: 15EDGRC-3.5-16P
IC2 = LAN8742A-CZ-TR: Value: LAN8742A-CZ-TR; Package: VQFN-24